# Altium project SiliconSubstance.PrjPcb
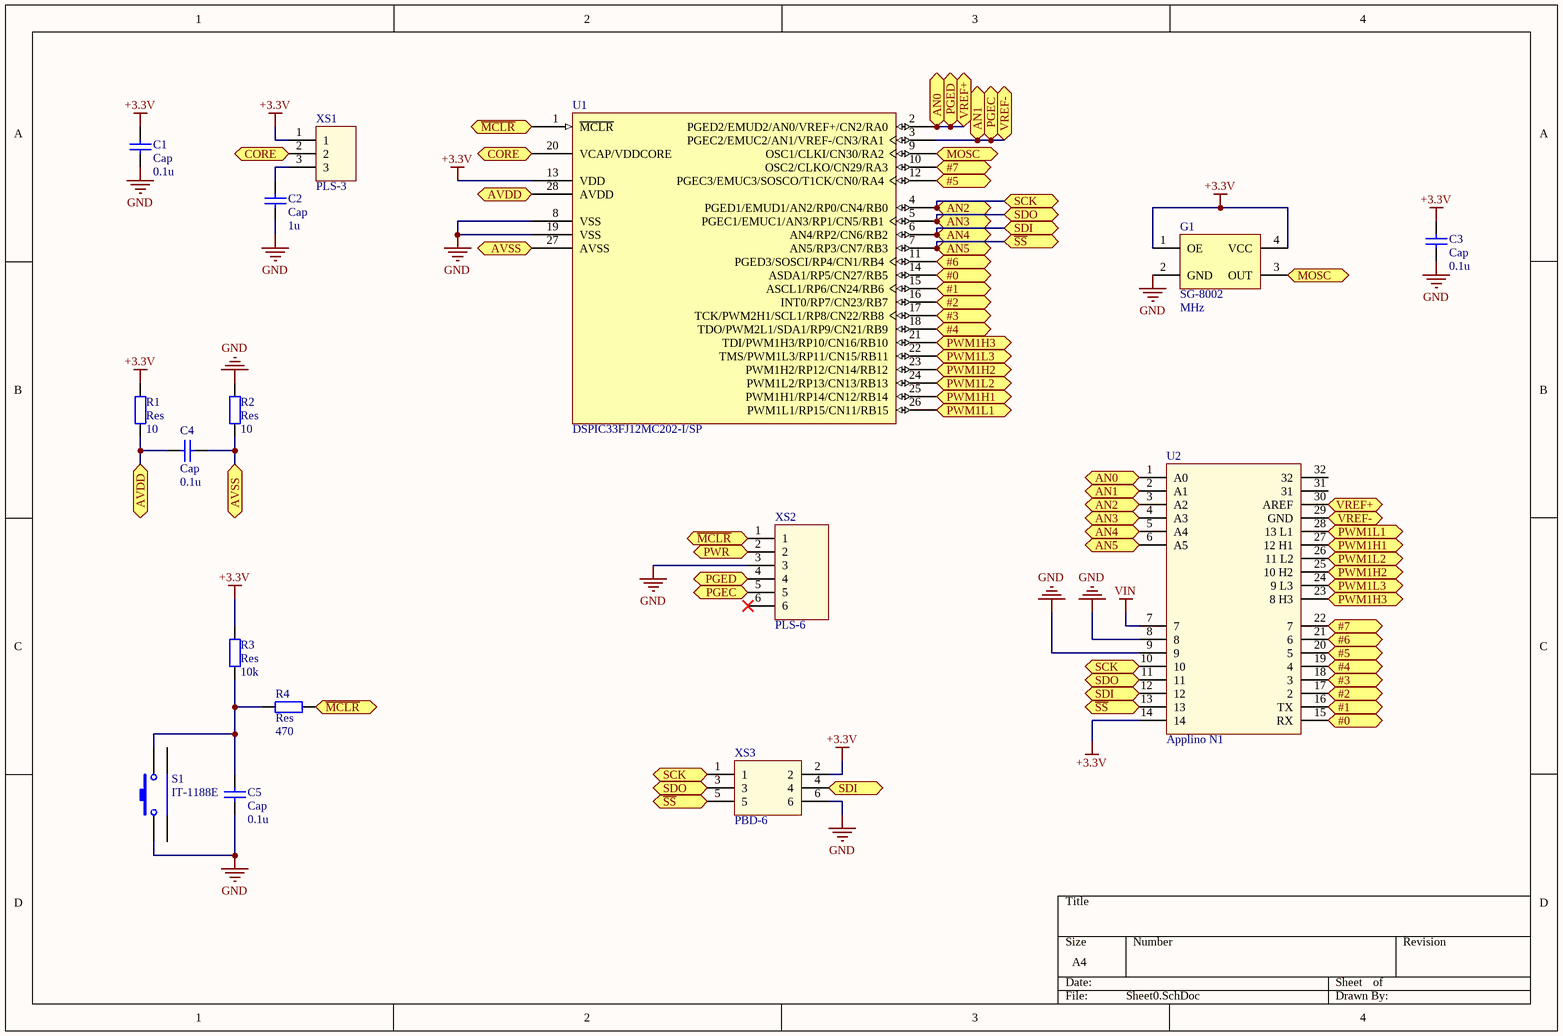
[diagram p0: Sheet0.SchDoc]
2 sheets, 33 parts. Net scope: flat (ports and power ports of the same name join across sheets).
Board file: SiliconeSubstance.PcbDoc
Sheets:
  Sheet0.SchDoc
  Sheet1.SchDoc

## Sheet Sheet0.SchDoc
size A4

### Parts
C1  Cap  value 0.1u  [0805]
C2  Cap  value 1u  [0805]
C3  Cap  value 0.1u  [0805]
C4  Cap  value 0.1u  [0805]
C5  Cap  value 0.1u  [0805]
G1  SG-8002  Frequency: MHz  [SMD7050]
R1  Res  value 10  [0805]
R2  Res  value 10  [0805]
R3  Res  value 10k  [0805]
R4  Res  value 470  [0805]
S1  IT-1188E  [IT-1188E]
U1  DSPIC33FJ12MC202-I/SP  [SPDIP300-SP28]
U2  Applino N1  [N1]
XS1  PLS-3  [PLS-3]
XS2  PLS-6  [PLS-6]
XS3  PBD-6  [PBD-6]

### Ports
#0, #1, #2, #3, #4, #5, #6, #7, AN0, AN1, AN2, AN3, AN4, AN5, AVDD, AVSS, CORE, MOSC, PGEC, PGED, PWM1H1, PWM1H2, PWM1H3, PWM1L1, PWM1L2, PWM1L3, PWR, SCK, SDI, SDO, VREF+, VREF-, ~{MCLR}, ~{SS}

### Nets
+3.3V: C1.2 C3.2 G1.1(OE) G1.4(VCC) R1.2 R3.2 U1.13(VDD) U2.14 XS1.1 XS3.2
GND: C1.1 C2.1 C3.1 C5.1 G1.2(GND) R2.2 S1.1 U1.8(VSS) U1.19(VSS) U2.8 U2.9 XS2.3 XS3.6
VIN: U2.7
NetC2_2: C2.2 XS1.3
NetC4_1: C4.1 R2.1 U1.27(AVSS) ; port AVSS
NetC4_2: C4.2 R1.1 U1.28(AVDD) ; port AVDD
NetC5_2: C5.2 R3.1 R4.2 S1.2
NetG1_3: G1.3(OUT) U1.9(OSC1/CLKI/CN30/RA2) ; port MOSC
NetR4_1: R4.1 U1.1(~{MCLR}) XS2.1 ; port ~{MCLR}
NetU1_2: U1.2(PGED2/EMUD2/AN0/VREF+/CN2/RA0) U2.1(A0) U2.30(AREF) XS2.4 ; port PGED, port AN0, port VREF+
NetU1_3: U1.3(PGEC2/EMUC2/AN1/VREF-/CN3/RA1) U2.2(A1) U2.29(GND) XS2.5 ; port PGEC, port AN1, port VREF-
NetU1_4: U1.4(PGED1/EMUD1/AN2/RP0/CN4/RB0) U2.3(A2) U2.10 XS3.1 ; port AN2, port SCK
NetU1_5: U1.5(PGEC1/EMUC1/AN3/RP1/CN5/RB1) U2.4(A3) U2.11 XS3.3 ; port AN3, port SDO
NetU1_6: U1.6(AN4/RP2/CN6/RB2) U2.5(A4) U2.12 XS3.4 ; port AN4, port SDI
NetU1_7: U1.7(AN5/RP3/CN7/RB3) U2.6(A5) U2.13 XS3.5 ; port AN5, port ~{SS}
NetU1_10: U1.10(OSC2/CLKO/CN29/RA3) U2.22(7) ; port #7
NetU1_11: U1.11(PGED3/SOSCI/RP4/CN1/RB4) U2.21(6) ; port #6
NetU1_12: U1.12(PGEC3/EMUC3/SOSCO/T1CK/CN0/RA4) U2.20(5) ; port #5
NetU1_14: U1.14(ASDA1/RP5/CN27/RB5) U2.15(RX) ; port #0
NetU1_15: U1.15(ASCL1/RP6/CN24/RB6) U2.16(TX) ; port #1
NetU1_16: U1.16(INT0/RP7/CN23/RB7) U2.17(2) ; port #2
NetU1_17: U1.17(TCK/PWM2H1/SCL1/RP8/CN22/RB8) U2.18(3) ; port #3
NetU1_18: U1.18(TDO/PWM2L1/SDA1/RP9/CN21/RB9) U2.19(4) ; port #4
NetU1_20: U1.20(VCAP/VDDCORE) XS1.2 ; port CORE
NetU1_21: U1.21(TDI/PWM1H3/RP10/CN16/RB10) U2.23(8_H3) ; port PWM1H3
NetU1_22: U1.22(TMS/PWM1L3/RP11/CN15/RB11) U2.24(9_L3) ; port PWM1L3
NetU1_23: U1.23(PWM1H2/RP12/CN14/RB12) U2.25(10_H2) ; port PWM1H2
NetU1_24: U1.24(PWM1L2/RP13/CN13/RB13) U2.26(11_L2) ; port PWM1L2
NetU1_25: U1.25(PWM1H1/RP14/CN12/RB14) U2.27(12_H1) ; port PWM1H1
NetU1_26: U1.26(PWM1L1/RP15/CN11/RB15) U2.28(13_L1) ; port PWM1L1
NetU6_1: XS2.2 ; port PWR

Not connected (* = marked no-connect by the designer): S1 3 4; U2 31 32; XS2 6*

### Library data of the parts
U1 = DSPIC33FJ12MC202-I/SP: High-Performance 16-bit Digital Signal Controller, 12 KB Flash, 1 KB RAM, 28-Pin SPDIP, Industrial Temperature; Manufacturer: Microchip; DatasheetVersion: revD, Jun-2009; PackageVersion: revBB, Aug-2009; PackageReference: SPDIP300-SP28; PackageDescription: 28-Lead Skinny Plastic Dual In-Line (SP) - 300 mil Body [SPDIP]; Supplier 1: Digi-Key; Supplier Part Number 1: DSPIC33FJ12MC202-I/SP-ND; Supplier 2: Farnell; Supplier Part Number 2: 1439610; Supplier 3: Newark; Supplier Part Number 3: 88K3899; Supplier 4: Mouser; Supplier Part Number 4: 579-DSPICJ12MC202ISP; Mounting Technology: Through Hole; PartNumber: DSPIC33FJ12MC202-I/SP; ComponentLink1Description: Manufacturer URL; ComponentLink1URL: http://www.microchip.com/; ComponentLink2Description: Datasheet; ComponentLink2URL: http://ww1.microchip.com/downloads/en/DeviceDoc/70265D.pdf; ComponentLink3Description: Package Specification; ComponentLink3URL: http://www.microchip.com/stellent/groups/techpub_sg/documents/packagingspec/en012702.pdf

## Sheet Sheet1.SchDoc
size A4
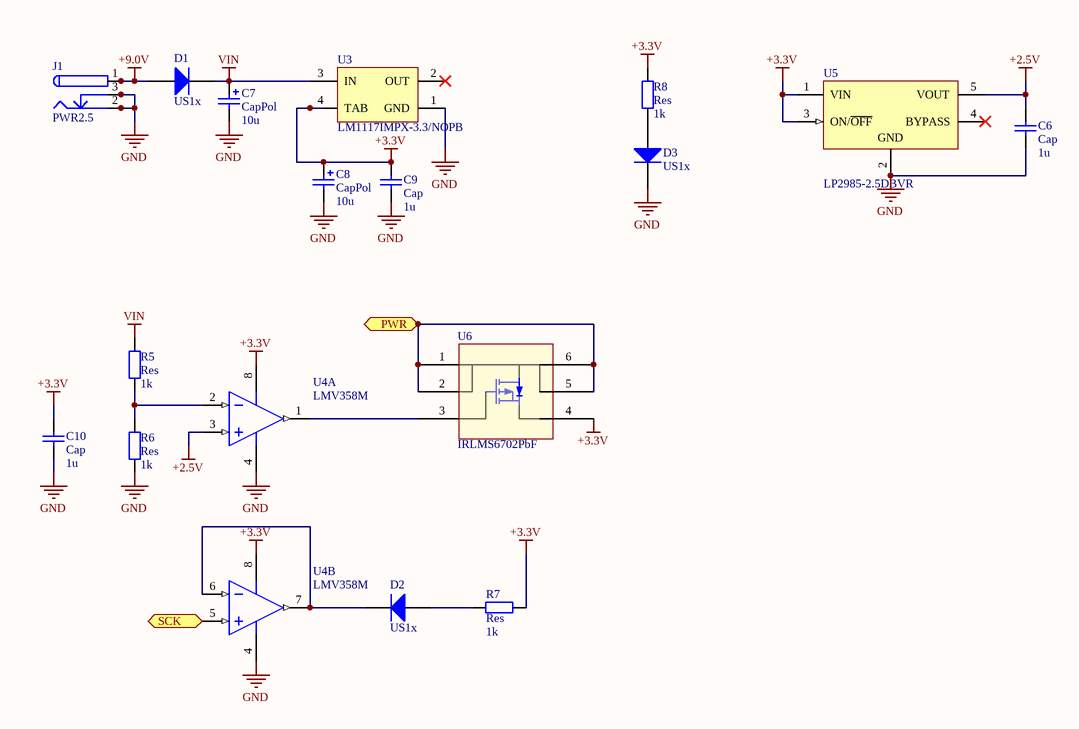
[diagram p1: Sheet1.SchDoc]

### Parts
C6  Cap  value 1u  [0805]
C7  CapPol  value 10u  [CASE C]
C8  CapPol  value 10u  [CASE C]
C9  Cap  value 1u  [0805]
C10  Cap  value 1u  [0805]
D1  US1x  [D0-214AC (SMA)]
D2  US1x  [D0-214AC (SMA)]
D3  US1x  [D0-214AC (SMA)]
J1  PWR2.5  [KLD-0202]
R5  Res  value 1k  [0805]
R6  Res  value 1k  [0805]
R7  Res  value 1k  [0805]
R8  Res  value 1k  [0805]
U3  LM1117IMPX-3.3/NOPB  [MP04A_N]
U4  LMV358M  [M08A_N]  (parts A,B of 2)
U5  LP2985-2.5DBVR  [TI-DBV5_N]
U6  IRLMS6702PbF  [SuperSOT-6]

### Ports
PWR, SCK

### Nets
+2.5V: C6.2 U4.3(INA+) U5.5(VOUT)
+3.3V: C8.1 C9.2 C10.2 R7.1 R8.1 U3.4(TAB) U4.8(V+) U5.1(VIN) U5.3(ON/~{OFF}) U6.4(S)
+9.0V: D1.1(A) J1.1 J1.1A
GND: C6.1 C7.2 C8.2 C9.1 C10.1 D3.2(K) J1.2 J1.2A J1.3 J1.3A R6.1 U3.1(GND) U4.4(V-) U5.2(GND)
VIN: C7.1 D1.2(K) R5.2 U3.3(IN)
NetD2_1: D2.1(A) R7.2
NetD2_2: D2.2(K) U4.6(INB-) U4.7(OUTB)
NetD3_1: D3.1(A) R8.2
NetR5_1: R5.1 R6.2 U4.2(INA-)
NetU1_4: U4.5(INB+) ; port SCK
NetU4_1: U4.1(OUTA) U6.3(G)
NetU6_1: U6.1(D) U6.2(D) U6.5(D) U6.6(D) ; port PWR

Not connected (* = marked no-connect by the designer): U3 2(OUT)*; U5 4(BYPASS)*

### Library data of the parts
C7 C8 = CapPol: Polarized Capacitor (Radial)
D1-D3 = US1x: Ultrafast Rectifier
J1 = PWR2.5: Low Voltage Power Supply Connector
U3 = LM1117IMPX-3.3/NOPB: 800mA Low-Dropout Linear Regulator, 4-pin SOT-223, Pb-Free; Manufacturer: National Semiconductor; PackageTopMarking: XYTT*N05B; PowerWise: N; CompType: LDO IC; High-Reliability: Y; DatasheetVersion: Apr-2006; PackageVersion: revB, Apr-2003; PackageReference: MP04A; PackageDescription: Molded SOT-223, 6.50 x 3.56 x 1.6mm Body, 4 Lead, 2.3mm Pitch; PartNumber: LM1117IMPX-3.3/NOPB; RoHS: Y; PinCount: 4; Code_JEDEC: TO-261-AA; Code_IPC: SOT223-4; ComponentLink1Description: Manufacturer URL; ComponentLink1URL: http://www.national.com/; ComponentLink2Description: LM1117 Datasheet; ComponentLink2URL: http://www.national.com/ds/LM/LM1117.pdf; ComponentLink3Description: LM1117 Web Page; ComponentLink3URL: http://www.national.com/pf/LM/LM1117.html; ComponentLink4Description: MP04A Package Page; ComponentLink4URL: http://www.national.com/packaging/folders/mp04a.html
U4 = LMV358M: General Purpose, Low Voltage, Rail-to-Rail Output Operational Amplifiers, 8-pin Narrow SOIC; Manufacturer: National Semiconductor; PackageTopMarking: NSZXTT*LMV*358M; PowerWise: N; High-Reliability: Y; DatasheetVersion: Sep-2009; PackageVersion: revM, May-2009; PackageReference: M08A; PackageDescription: SOIC Narrow, 4.9 x 3.9 x 1.45mm, 8 Lead, 1.27mm Pitch; PartNumber: LMV358M; RoHS: N; PinCount: 8; CompType: Amplifiers; Code_JEDEC: MS-012-AA; Code_IPC: SOIC127P600-8; ComponentLink1Description: Manufacturer URL; ComponentLink1URL: http://www.national.com/; ComponentLink2Description: LMV358 Datasheet; ComponentLink2URL: http://www.national.com/ds/LM/LMV358.pdf; ComponentLink3Description: LMV358 Web Page; ComponentLink3URL: http://www.national.com/pf/LM/LMV358.html; ComponentLink4Description: M08A Package Page; ComponentLink4URL: http://www.national.com/packaging/folders/m08a.html
U5 = LP2985-10DBVR: Single Output Low Noise LDO, 150 mA, Fixed 10 V Output, 2.2 to 16 V Input, with Low IQ, 5-pin SOT-23 (DBV), -40 to 125 degC, Green (RoHS & no Sb/Br); Manufacturer: Texas Instruments; Accuracy(%): 1.5; Fixed Output Options(V): 10; Iout(Max)(A): 0.15; Iq(Typ)(mA): 0.85; SubFamily: Single Channel LDO; Vdo(Typ)(mV): 280; Vin(Max)(V): 16; Vin(Min)(V): 2.2; DatasheetVersion: SLVS522N; PackageVersion: 4073253-4/K; PackageReference: DBV5; PackageDescription: 5-Pin Plastic Small Outline, Body 1.60 Г— 2.90 mm, Pitch 0.95 mm; Supplier 1: Digi-Key; Supplier Part Number 1: 296-24263-2-ND; Supplier 2: Digi-Key; Supplier Part Number 2: 296-24263-1-ND; Supplier 3: Digi-Key; Supplier Part Number 3: 296-24263-6-ND; Supplier 4: Newark; Supplier Part Number 4: 24R9588; Supplier 5: Mouser; Supplier Part Number 5: 595-LP2985-10DBVR; Eco-Plan: Green (RoHS & no Sb/Br); Vout Adj(Max)(V): 10; Vout Adj(Min)(V): 10; Mounting Technology: Surface Mount; Code_JEDEC: MO-178; PartNumber: LP2985-10DBVR; ComponentLink1Description: Manufacturer URL; ComponentLink1URL: http://www.ti.com/; ComponentLink2Description: Datasheet; ComponentLink2URL: http://www.ti.com/general/docs/lit/getliterature.tsp?genericPartNumber=LP2985-10&fileType=pdf; ComponentLink3Description: Package Specification; ComponentLink3URL: http://www.ti.com/litv/pdf/mpds018i

## Nets that join several sheets
+3.3V: Sheet0 (10 pins), Sheet1 (10 pins)
GND: Sheet0 (13 pins), Sheet1 (14 pins)
VIN: Sheet0 (U2.7), Sheet1 (C7.1 D1.2 R5.2 U3.3)
NetU1_4: Sheet0 (U1.4 U2.3 U2.10 XS3.1), Sheet1 (U4.5)
NetU6_1: Sheet0 (XS2.2), Sheet1 (U6.1 U6.2 U6.5 U6.6)